# Altium project NRF24L01_screen.PrjPcb
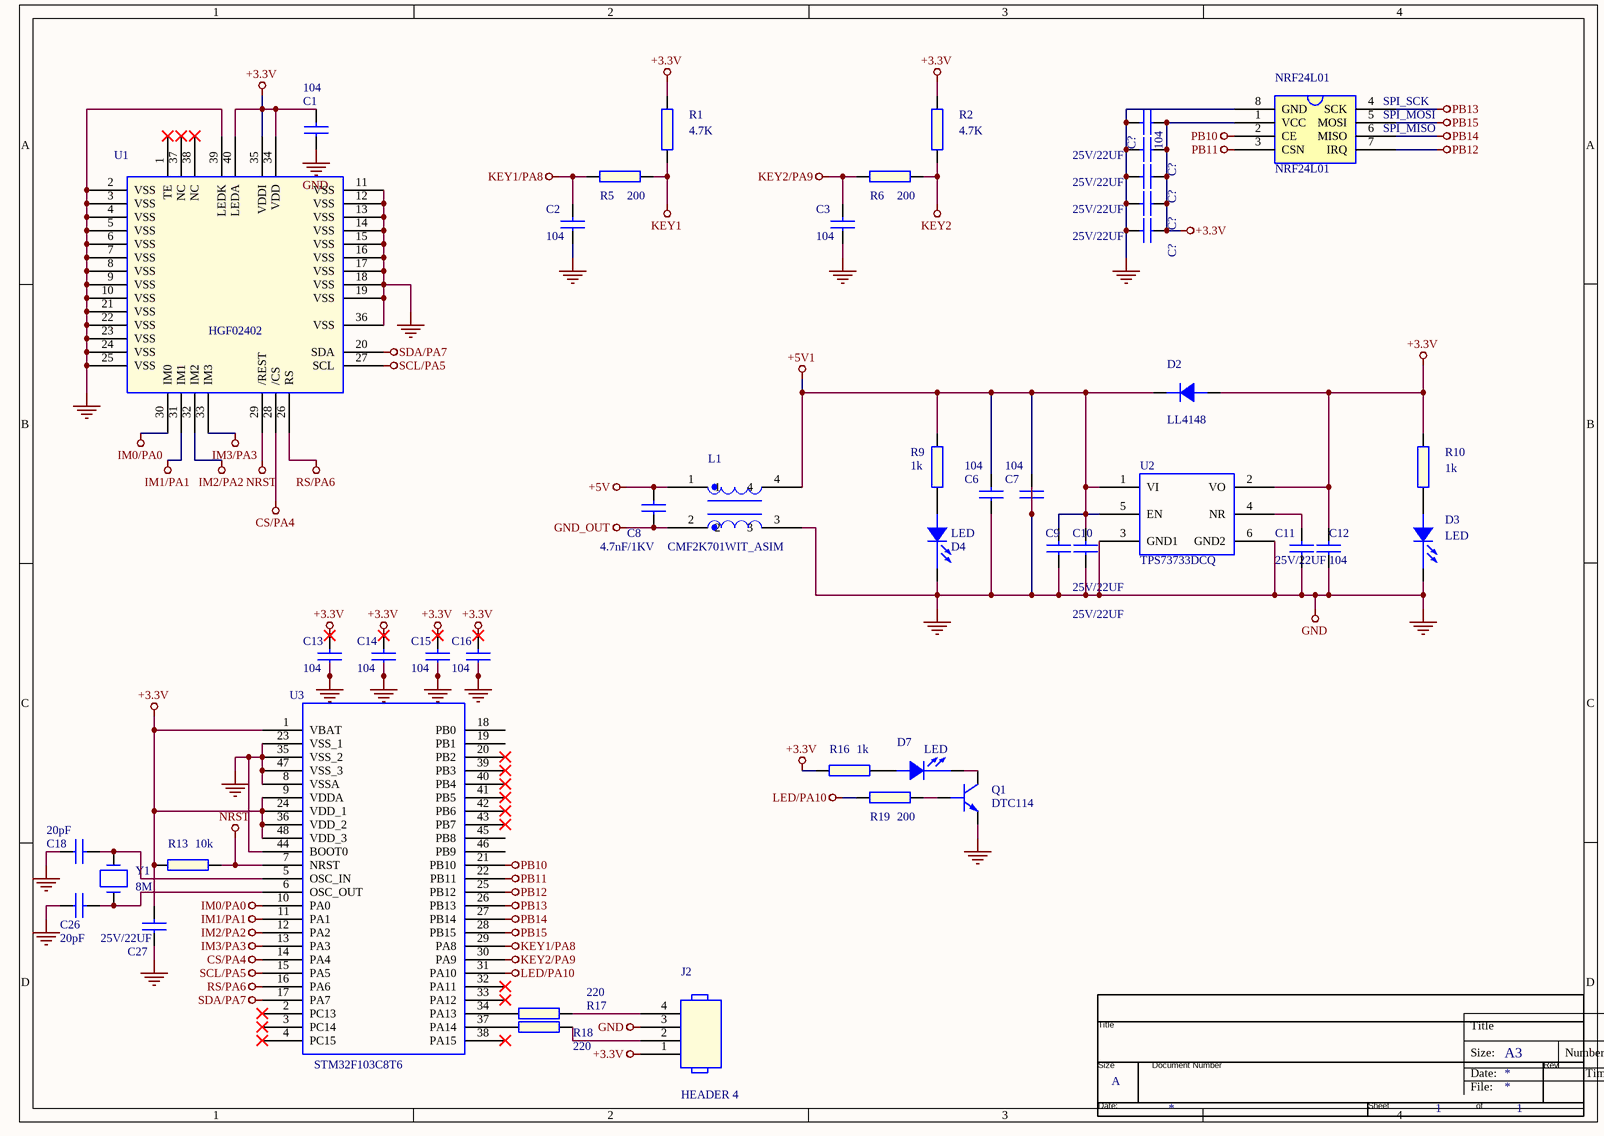
[diagram p0: NRF24L01_screen.SchDoc]
1 sheet, 46 parts. Net scope: global (net labels, ports and power ports of the same name join across sheets).

## Sheet NRF24L01_screen.SchDoc
size 297 x 209 mm; Organization: Altium Limited; Address1: L3, 12a Rodborough Rd; Address2: Frenchs Forest; Address3: NSW; Address4: Australia 2086

### Parts
(Parts that share a designator on the sheet are numbered #1, #2 ... from top to bottom, then left to right.)
*  Page Count: 1  Page Size: A  (hidden comment: TitleBlock0)  (graphical)
C1  104  [0603]
C2  104  [0603]
C3  104  [0603]
C6  104  [0603]
C7  104  [0603]
C8  4.7nF/1KV  [1206C]
C9  25V/22UF  [1210]
C10  25V/22UF  [1210]
C11  25V/22UF  [1210]
C12  104  [0603]
C13  104  [0603]
C14  104  [0603]
C15  104  [0603]
C16  104  [0603]
C18  20pF  [0603]
C26  20pF  [0603]
C27  25V/22UF  [1210]
C?#1  104  [0603]
C?#2  25V/22UF  [1210]
C?#3  25V/22UF  [1210]
C?#4  25V/22UF  [1210]
C?#5  25V/22UF  [1210]
D2  LL4148  [LL4148]
D3  LED  [0805+]
D4  LED  [0805+]
D7  LED  [0805+]
J2  HEADER 4  [SIP-4X1]
L1  CMF2K701WIT_ASIM  [MF2K701WIT_ASIM]
NRF24L01  NRF24L01
Q1  DTC114  [SOT-416]
R1  4.7K  [0603]
R2  4.7K  [0603]
R5  200  [0603]
R6  200  [0603]
R9  1k  [0603]
R10  1k  [0603]
R13  10k  [0603]
R16  1k  [0603]
R17  220  [0603]
R18  220  [0603]
R19  200  [0603R]
U1  HGF02402  [FPC$2F$40$2F$0.5]
U2  TPS73733DCQ  [TPS73733]
U3  STM32F103C8T6  [LQFP-48-0.508]
Y1  8M  [NX5032GA]

### Nets
+3.3V: C1.2 C12.2 C13.2 C14.2 C15.2 C16.2 C27.2 C?#1.1 C?#2.1 C?#3.1 C?#4.1 C?#5.1 D2.2 J2.1 NRF24L01.1(VCC) R1.2 R2.2 R10.2 R13.2 R16.1 U1.34(VDD) U1.35(VDDI) U1.40(LEDA) U2.2(VO) U3.1(VBAT) U3.9(VDDA) U3.24(VDD_1) U3.36(VDD_2) U3.48(VDD_3)
+5V: C8.2 L1.1
+5V1: C6.2 C7.2 C9.2 C10.2 D2.1 L1.4 R9.2 U2.1(VI) U2.5(EN)
CS/PA4: U1.28(/CS) U3.14(PA4)
GND: C1.1 C2.1 C3.1 C6.1 C7.1 C9.1 C10.1 C11.1 C12.1 C13.1 C14.1 C15.1 C16.1 C18.1 C26.1 C27.1 C?#1.2 C?#2.2 C?#3.2 C?#4.2 C?#5.2 D3.1(`) D4.1(`) J2.3 L1.3 NRF24L01.8(GND) Q1.1(E) U1.2(VSS) U1.3(VSS) U1.4(VSS) U1.5(VSS) U1.6(VSS) U1.7(VSS) U1.8(VSS) U1.9(VSS) U1.10(VSS) U1.11(VSS) U1.12(VSS) U1.13(VSS) U1.14(VSS) U1.15(VSS) U1.16(VSS) U1.17(VSS) U1.18(VSS) U1.19(VSS) U1.21(VSS) U1.22(VSS) U1.23(VSS) U1.24(VSS) U1.25(VSS) U1.36(VSS) U1.39(LEDK) U2.3(GND1) U2.6(GND2) U3.8(VSSA) U3.23(VSS_1) U3.35(VSS_2) U3.44(BOOT0) U3.47(VSS_3)
GND_OUT: C8.1 L1.2
IM0/PA0: U1.30(IM0) U3.10(PA0)
IM1/PA1: U1.31(IM1) U3.11(PA1)
IM2/PA2: U1.32(IM2) U3.12(PA2)
IM3/PA3: U1.33(IM3) U3.13(PA3)
KEY1: R1.1 R5.2
KEY1/PA8: C2.2 R5.1 U3.29(PA8)
KEY2: R2.1 R6.2
KEY2/PA9: C3.2 R6.1 U3.30(PA9)
LED/PA10: R19.1 U3.31(PA10)
NRST: R13.1 U1.29(/REST) U3.7(NRST)
PB10: NRF24L01.2(CE) U3.21(PB10)
PB11: NRF24L01.3(CSN) U3.22(PB11)
PB12: NRF24L01.7(IRQ) U3.25(PB12)
PB13: NRF24L01.4(SCK) U3.26(PB13)
PB14: NRF24L01.6(MISO) U3.27(PB14)
PB15: NRF24L01.5(MOSI) U3.28(PB15)
RS/PA6: U1.26(RS) U3.16(PA6)
SCL/PA5: U1.27(SCL) U3.15(PA5)
SDA/PA7: U1.20(SDA) U3.17(PA7)
NetC11_2: C11.2 U2.4(NR)
NetC18_2: C18.2 U3.5(OSC_IN) Y1.2
NetC26_2: C26.2 U3.6(OSC_OUT) Y1.1
NetD3_2: D3.2 R10.1
NetD4_2: D4.2 R9.1
NetD7_1: D7.1(`) Q1.3(C)
NetD7_2: D7.2 R16.2
NetJ2_2: J2.2 R18.2
NetJ2_4: J2.4 R17.2
NetQ1_2: Q1.2(B) R19.2
NetR17_1: R17.1 U3.34(PA13)
NetR18_1: R18.1 U3.37(PA14)

Not connected (* = marked no-connect by the designer): U1 1(TE)* 37(NC)* 38(NC)*; U3 2(PC13)* 3(PC14)* 4(PC15)* 18(PB0) 19(PB1) 20(PB2)* 32(PA11)* 33(PA12)* 38(PA15)* 39(PB3)* 40(PB4)* 41(PB5)* 42(PB6)* 43(PB7)* 45(PB8) 46(PB9)

### Notes on the sheet
- (near NRF24L01) SPI_SCK
- (near NRF24L01) SPI_MOSI
- (near NRF24L01) SPI_MISO
- Title
- Size:
- Date:
- A3
- Number:
- Time:
- Revision:
- Sheet
- of
- File:
- (in symbol TitleBlock0) Title; Size; Document Number; Rev; Date:; Sheet; of

### Library data of the parts
C1-C3 C6 C7 C9-C16 C18 C26 C27 C?#1-C?#5 = CAP NP_0
  C1-C3 C6 C7 C12-C16 C18 C26 C?#1: PCB Footprint: 0603
  C9-C11 C27 C?#2-C?#5: PCB Footprint: 1210
C8 = CAP NP_0: PCB Footprint: 1210
D2 = DIODE_5: PCB Footprint: LL4148
D3 D4 D7 = LED_7: PCB Footprint: 0805+
Q1 = 2N1069_7: PspiceTemplate: Q^@REFDES %C %B %E; PCB Footprint: SOT-416
R1 R2 R5 R6 R9 R10 R13 R16-R18 = R2: PCB Footprint: 0603
R19 = R2: PCB Footprint: 0603
U1 = HGF02402_0: PCB Footprint: FPC/40/0.5
U2 = TPS73733DCQ_1: PCB Footprint: TPS73733
U3 = STM32F103C8T6: ID: STM32F03C8T6; PCB Footprint: LQFP-48-0.508
Y1 = CRYSTAL: PCB Footprint: NX5032GA
* = TitleBlock0: Page Number: 1; Page Create Date: March  8, 1995; Page Modify Date: *
J2 = HEADER 4: PCB Footprint: SIP-4X1
L1 = CMF2K701WIT_ASIM: PCB Footprint: MF2K701WIT_ASIM